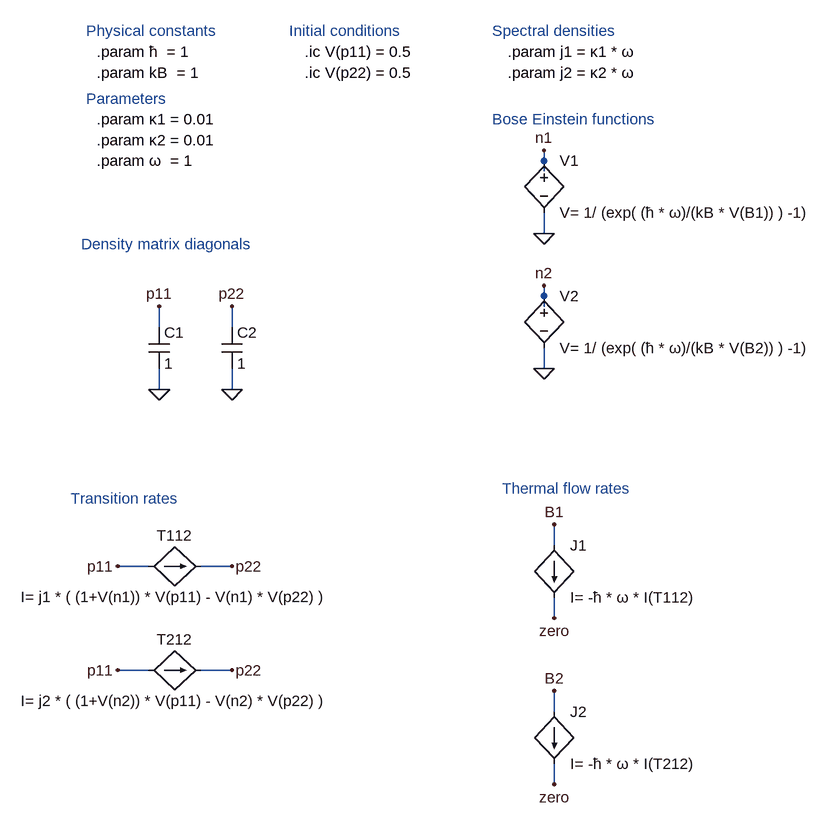
[diagram p0: schematic conducting_TLS.asc]
conducting_TLS.asc, the LTspice schematic file:
Version 4
SHEET 1 1168 1376
WIRE 48 208 48 192
WIRE 48 224 48 208
WIRE 48 320 48 288
WIRE 48 416 48 400
WIRE 48 432 48 416
WIRE -544 464 -544 432
WIRE -432 464 -432 432
WIRE 48 528 48 496
WIRE -544 560 -544 528
WIRE -432 560 -432 528
WIRE 64 800 64 768
WIRE -560 832 -608 832
WIRE -432 832 -480 832
WIRE 64 912 64 880
WIRE -560 992 -608 992
WIRE -432 992 -480 992
WIRE 64 1056 64 1024
WIRE 64 1168 64 1136
FLAG -544 560 0
FLAG -544 432 p11
FLAG -432 560 0
FLAG -432 432 p22
FLAG -608 832 p11
FLAG -432 832 p22
FLAG -608 992 p11
FLAG -432 992 p22
FLAG 64 768 B1
FLAG 64 1024 B2
FLAG 48 320 0
FLAG 48 192 n1
FLAG 48 528 0
FLAG 48 400 n2
FLAG 64 912 zero
FLAG 64 1168 zero
SYMBOL cap -560 464 R0
SYMATTR InstName C1
SYMATTR Value 1
SYMBOL cap -448 464 R0
SYMATTR InstName C2
SYMATTR Value 1
SYMBOL bi -560 832 R270
WINDOW 0 32 40 VTop 2
WINDOW 3 -32 40 VBottom 2
SYMATTR InstName T112
SYMATTR Value I= j1 * ( (1+V(n1)) * V(p11) - V(n1) * V(p22) )
SYMBOL bi -560 992 R270
WINDOW 0 32 40 VTop 2
WINDOW 3 -32 40 VBottom 2
SYMATTR InstName T212
SYMATTR Value I= j2 * ( (1+V(n2)) * V(p11) - V(n2) * V(p22) )
SYMBOL bi 64 800 R0
SYMATTR InstName J1
SYMATTR Value I= -ħ * ω * I(T112)
SYMBOL bi 64 1056 R0
SYMATTR InstName J2
SYMATTR Value I= -ħ * ω * I(T212)
SYMBOL bv 48 192 R0
SYMATTR InstName V1
SYMATTR Value V= 1/ (exp( (ħ * ω)/(kB * V(B1)) ) -1)
SYMBOL bv 48 400 R0
SYMATTR InstName V2
SYMATTR Value V= 1/ (exp( (ħ * ω)/(kB * V(B2)) ) -1)
TEXT -320 40 Left 2 !.ic V(p11) = 0.5
TEXT -32 8 Left 2 ;Spectral densities
TEXT -8 40 Left 2 !.param j1 = κ1 * ω
TEXT -8 72 Left 2 !.param j2 = κ2 * ω
TEXT -344 8 Left 2 ;Initial conditions
TEXT -320 72 Left 2 !.ic V(p22) = 0.5
TEXT -664 336 Left 2 ;Density matrix diagonals
TEXT -680 728 Left 2 ;Transition rates
TEXT -16 712 Left 2 ;Thermal flow rates
TEXT -656 112 Left 2 ;Parameters
TEXT -640 144 Left 2 !.param κ1 = 0.01
TEXT -640 176 Left 2 !.param κ2 = 0.01
TEXT -640 208 Left 2 !.param ω  = 1
TEXT -640 40 Left 2 !.param ħ  = 1
TEXT -640 72 Left 2 !.param kB  = 1
TEXT -656 8 Left 2 ;Physical constants
TEXT -32 144 Left 2 ;Bose Einstein functions

The netlist it stands for:
* conducting_TLS.asc
C1 p11 0 1
C2 p22 0 1
B§T112 p11 p22 I= j1 * ( (1+V(n1)) * V(p11) - V(n1) * V(p22) )
B§T212 p11 p22 I= j2 * ( (1+V(n2)) * V(p11) - V(n2) * V(p22) )
B§J1 B1 zero I= -ħ * ω * I(T112)
B§J2 B2 zero I= -ħ * ω * I(T212)
B§V1 n1 0 V= 1/ (exp( (ħ * ω)/(kB * V(B1)) ) -1)
B§V2 n2 0 V= 1/ (exp( (ħ * ω)/(kB * V(B2)) ) -1)
.ic V(p11) = 0.5
* Spectral densities
.param j1 = κ1 * ω
.param j2 = κ2 * ω
* Initial conditions
.ic V(p22) = 0.5
* Density matrix diagonals
* Transition rates
* Thermal flow rates
* Parameters
.param κ1 = 0.01
.param κ2 = 0.01
.param ω  = 1
.param ħ  = 1
.param kB  = 1
* Physical constants
* Bose Einstein functions
.backanno
.end